# Altium schematic sheet 03-ORIN_HIGH_SPEED_SIGNAL_1.SchDoc: KARGOBOT-TBOX-V2.0
size 513 x 386 mm; Page Create Date: March  8, 1995; Page Number: 6; Page Size: C; Page Count: 81; RevCode: A; DsnPath: C:\Users\Administrator\Desktop\123\KARGOBOT-TCU-ORIN-V1.1.DSN; SchematicName: KARGOBT-TCU-ORIN-V1.1; PageName: 06-ORIN_HIGH_SPEED_SIGNAL_1; PageSize: C; TopSchematic: True
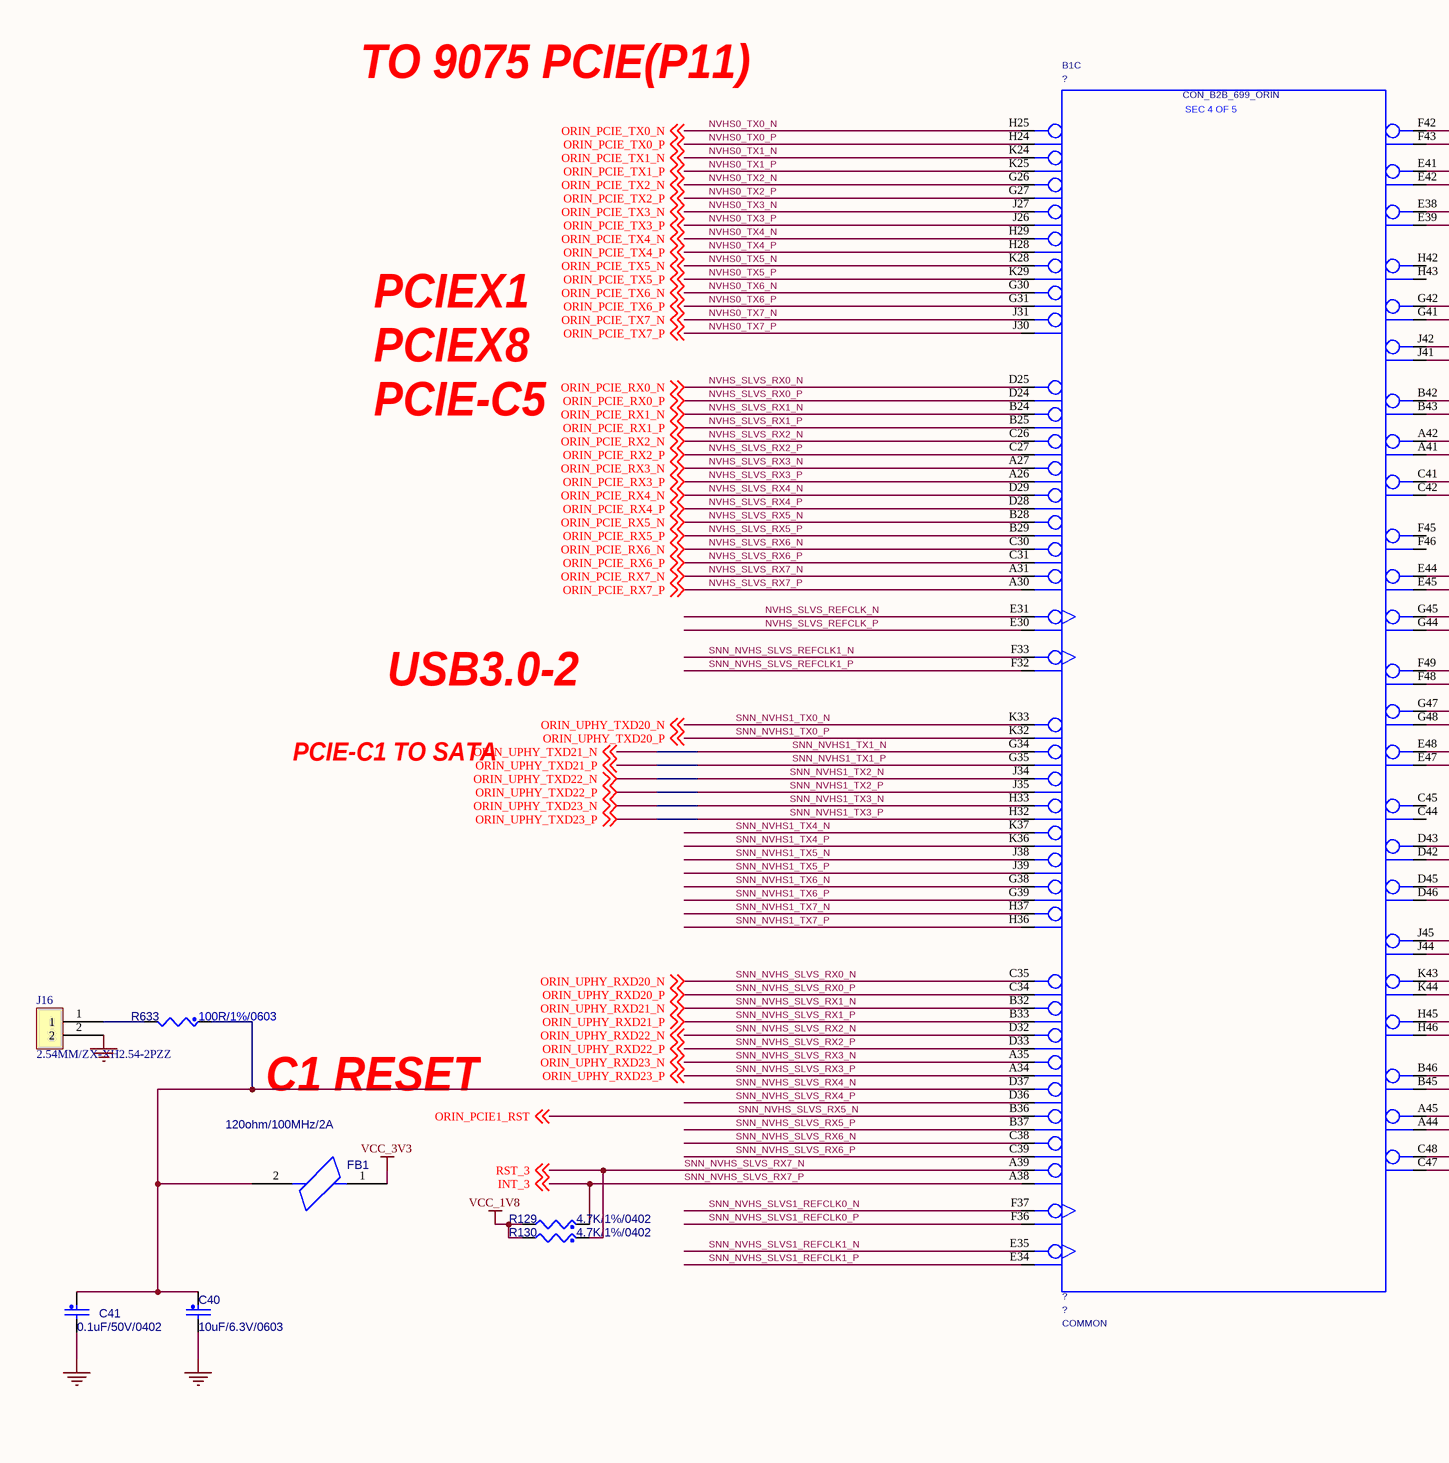
[diagram p0: 03-ORIN_HIGH_SPEED_SIGNAL_1.SchDoc, left]
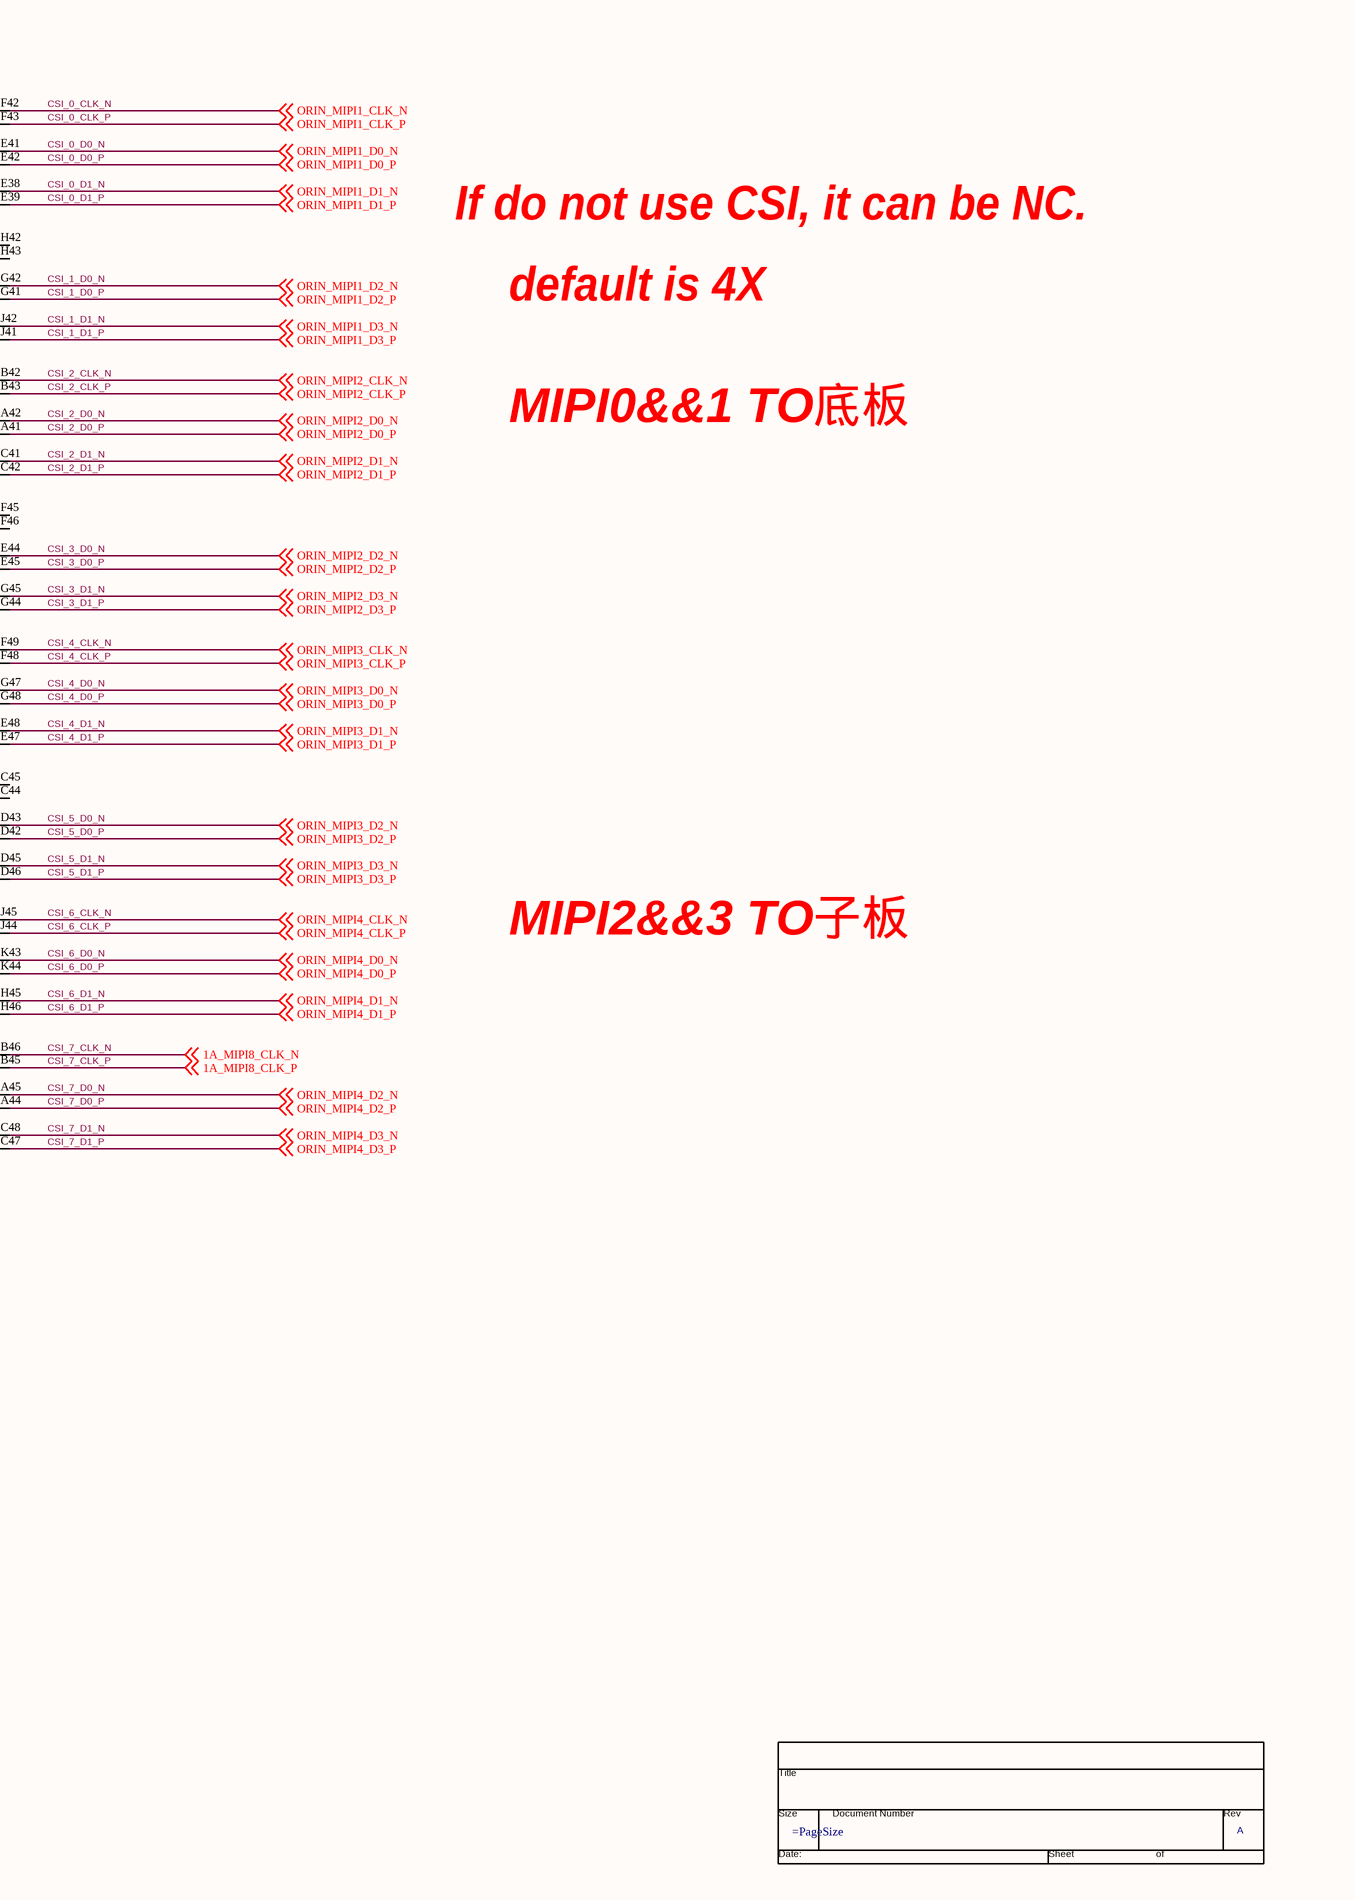
[diagram p1: 03-ORIN_HIGH_SPEED_SIGNAL_1.SchDoc, right]

## Parts
*  RevCode: A  (graphical)
B1  SKU: COMMON  [CON_MIRMEZ_699_BGA_ST_P009_P013_P015_REVERSE]  (hidden comment: CON_B2B_699_ORIN)  (part C of 5)
C40  value 10uF/6.3V/0603  [C0603]  (hidden comment: CAP_NP)
C41  value 0.1uF/50V/0402  [C0402]  (hidden comment: CAP_NP)
FB1  value 120ohm/100MHz/2A  [L0603]  (hidden comment: BEAD_FERRITE)
J16  2.54MM/ZX-XH2.54-2PZZ  [CONN-TH_2P-P2.50_HX25003-2A]
R129  value 4.7K/1%/0402  [R0402]  (hidden comment: RES_Dup2)
R130  value 4.7K/1%/0402  [R0402]  (hidden comment: RES_Dup2)
R633  value 100R/1%/0603  [R0603]  (hidden comment: RES_Dup2)

## Nets
GND: C40.2 C41.2 J16.2
VCC_1V8: R129.2 R130.2
VCC_3V3: FB1.1
CSI_0_CLK_N: B1.F42(CSI0_CLK_N) ; off-sheet ORIN_MIPI1_CLK_N  [also labelled ORIN_MIPI1_CLK_N]
CSI_0_CLK_P: B1.F43(CSI0_CLK_P) ; off-sheet ORIN_MIPI1_CLK_P  [also labelled ORIN_MIPI1_CLK_P]
CSI_0_D0_N: B1.E41(CSI0_D0_N) ; off-sheet ORIN_MIPI1_D0_N  [also labelled ORIN_MIPI1_D0_N]
CSI_0_D0_P: B1.E42(CSI0_D0_P) ; off-sheet ORIN_MIPI1_D0_P  [also labelled ORIN_MIPI1_D0_P]
CSI_0_D1_N: B1.E38(CSI0_D1_N) ; off-sheet ORIN_MIPI1_D1_N  [also labelled ORIN_MIPI1_D1_N]
CSI_0_D1_P: B1.E39(CSI0_D1_P) ; off-sheet ORIN_MIPI1_D1_P  [also labelled ORIN_MIPI1_D1_P]
CSI_1_D0_N: B1.G42(CSI1_D0_N) ; off-sheet ORIN_MIPI1_D2_N  [also labelled ORIN_MIPI1_D2_N]
CSI_1_D0_P: B1.G41(CSI1_D0_P) ; off-sheet ORIN_MIPI1_D2_P  [also labelled ORIN_MIPI1_D2_P]
CSI_1_D1_N: B1.J42(CSI1_D1_N) ; off-sheet ORIN_MIPI1_D3_N  [also labelled ORIN_MIPI1_D3_N]
CSI_1_D1_P: B1.J41(CSI1_D1_P) ; off-sheet ORIN_MIPI1_D3_P  [also labelled ORIN_MIPI1_D3_P]
CSI_2_CLK_N: B1.B42(CSI2_CLK_N) ; off-sheet ORIN_MIPI2_CLK_N  [also labelled ORIN_MIPI2_CLK_N]
CSI_2_CLK_P: B1.B43(CSI2_CLK_P) ; off-sheet ORIN_MIPI2_CLK_P  [also labelled ORIN_MIPI2_CLK_P]
CSI_2_D0_N: B1.A42(CSI2_D0_N) ; off-sheet ORIN_MIPI2_D0_N  [also labelled ORIN_MIPI2_D0_N]
CSI_2_D0_P: B1.A41(CSI2_D0_P) ; off-sheet ORIN_MIPI2_D0_P  [also labelled ORIN_MIPI2_D0_P]
CSI_2_D1_N: B1.C41(CSI2_D1_N) ; off-sheet ORIN_MIPI2_D1_N  [also labelled ORIN_MIPI2_D1_N]
CSI_2_D1_P: B1.C42(CSI2_D1_P) ; off-sheet ORIN_MIPI2_D1_P  [also labelled ORIN_MIPI2_D1_P]
CSI_3_D0_N: B1.E44(CSI3_D0_N) ; off-sheet ORIN_MIPI2_D2_N  [also labelled ORIN_MIPI2_D2_N]
CSI_3_D0_P: B1.E45(CSI3_D0_P) ; off-sheet ORIN_MIPI2_D2_P  [also labelled ORIN_MIPI2_D2_P]
CSI_3_D1_N: B1.G45(CSI3_D1_N) ; off-sheet ORIN_MIPI2_D3_N  [also labelled ORIN_MIPI2_D3_N]
CSI_3_D1_P: B1.G44(CSI3_D1_P) ; off-sheet ORIN_MIPI2_D3_P  [also labelled ORIN_MIPI2_D3_P]
CSI_4_CLK_N: B1.F49(CSI4_CLK_N) ; off-sheet ORIN_MIPI3_CLK_N  [also labelled ORIN_MIPI3_CLK_N]
CSI_4_CLK_P: B1.F48(CSI4_CLK_P) ; off-sheet ORIN_MIPI3_CLK_P  [also labelled ORIN_MIPI3_CLK_P]
CSI_4_D0_N: B1.G47(CSI4_D0_N) ; off-sheet ORIN_MIPI3_D0_N  [also labelled ORIN_MIPI3_D0_N]
CSI_4_D0_P: B1.G48(CSI4_D0_P) ; off-sheet ORIN_MIPI3_D0_P  [also labelled ORIN_MIPI3_D0_P]
CSI_4_D1_N: B1.E48(CSI4_D1_N) ; off-sheet ORIN_MIPI3_D1_N  [also labelled ORIN_MIPI3_D1_N]
CSI_4_D1_P: B1.E47(CSI4_D1_P) ; off-sheet ORIN_MIPI3_D1_P  [also labelled ORIN_MIPI3_D1_P]
CSI_5_D0_N: B1.D43(CSI5_D0_N) ; off-sheet ORIN_MIPI3_D2_N  [also labelled ORIN_MIPI3_D2_N]
CSI_5_D0_P: B1.D42(CSI5_D0_P) ; off-sheet ORIN_MIPI3_D2_P  [also labelled ORIN_MIPI3_D2_P]
CSI_5_D1_N: B1.D45(CSI5_D1_N) ; off-sheet ORIN_MIPI3_D3_N  [also labelled ORIN_MIPI3_D3_N]
CSI_5_D1_P: B1.D46(CSI5_D1_P) ; off-sheet ORIN_MIPI3_D3_P  [also labelled ORIN_MIPI3_D3_P]
CSI_6_CLK_N: B1.J45(CSI6_CLK_N) ; off-sheet ORIN_MIPI4_CLK_N  [also labelled ORIN_MIPI4_CLK_N]
CSI_6_CLK_P: B1.J44(CSI6_CLK_P) ; off-sheet ORIN_MIPI4_CLK_P  [also labelled ORIN_MIPI4_CLK_P]
CSI_6_D0_N: B1.K43(CSI6_D0_N) ; off-sheet ORIN_MIPI4_D0_N  [also labelled ORIN_MIPI4_D0_N]
CSI_6_D0_P: B1.K44(CSI6_D0_P) ; off-sheet ORIN_MIPI4_D0_P  [also labelled ORIN_MIPI4_D0_P]
CSI_6_D1_N: B1.H45(CSI6_D1_N) ; off-sheet ORIN_MIPI4_D1_N  [also labelled ORIN_MIPI4_D1_N]
CSI_6_D1_P: B1.H46(CSI6_D1_P) ; off-sheet ORIN_MIPI4_D1_P  [also labelled ORIN_MIPI4_D1_P]
CSI_7_CLK_N: B1.B46(CSI7_CLK_N) ; off-sheet 1A_MIPI8_CLK_N  [also labelled 1A_MIPI8_CLK_N]
CSI_7_CLK_P: B1.B45(CSI7_CLK_P) ; off-sheet 1A_MIPI8_CLK_P  [also labelled 1A_MIPI8_CLK_P]
CSI_7_D0_N: B1.A45(CSI7_D0_N) ; off-sheet ORIN_MIPI4_D2_N  [also labelled ORIN_MIPI4_D2_N]
CSI_7_D0_P: B1.A44(CSI7_D0_P) ; off-sheet ORIN_MIPI4_D2_P  [also labelled ORIN_MIPI4_D2_P]
CSI_7_D1_N: B1.C48(CSI7_D1_N) ; off-sheet ORIN_MIPI4_D3_N  [also labelled ORIN_MIPI4_D3_N]
CSI_7_D1_P: B1.C47(CSI7_D1_P) ; off-sheet ORIN_MIPI4_D3_P  [also labelled ORIN_MIPI4_D3_P]
NVHS0_TX0_N: B1.H25(NVHS0_TX0_N) ; off-sheet ORIN_PCIE_TX0_N  [also labelled ORIN_PCIE_TX0_N]
NVHS0_TX0_P: B1.H24(NVHS0_TX0_P) ; off-sheet ORIN_PCIE_TX0_P  [also labelled ORIN_PCIE_TX0_P]
NVHS0_TX1_N: B1.K24(NVHS0_TX1_N) ; off-sheet ORIN_PCIE_TX1_N  [also labelled ORIN_PCIE_TX1_N]
NVHS0_TX1_P: B1.K25(NVHS0_TX1_P) ; off-sheet ORIN_PCIE_TX1_P  [also labelled ORIN_PCIE_TX1_P]
NVHS0_TX2_N: B1.G26(NVHS0_TX2_N) ; off-sheet ORIN_PCIE_TX2_N  [also labelled ORIN_PCIE_TX2_N]
NVHS0_TX2_P: B1.G27(NVHS0_TX2_P) ; off-sheet ORIN_PCIE_TX2_P  [also labelled ORIN_PCIE_TX2_P]
NVHS0_TX3_N: B1.J27(NVHS0_TX3_N) ; off-sheet ORIN_PCIE_TX3_N  [also labelled ORIN_PCIE_TX3_N]
NVHS0_TX3_P: B1.J26(NVHS0_TX3_P) ; off-sheet ORIN_PCIE_TX3_P  [also labelled ORIN_PCIE_TX3_P]
NVHS0_TX4_N: B1.H29(NVHS0_TX4_N) ; off-sheet ORIN_PCIE_TX4_N  [also labelled ORIN_PCIE_TX4_N]
NVHS0_TX4_P: B1.H28(NVHS0_TX4_P) ; off-sheet ORIN_PCIE_TX4_P  [also labelled ORIN_PCIE_TX4_P]
NVHS0_TX5_N: B1.K28(NVHS0_TX5_N) ; off-sheet ORIN_PCIE_TX5_N  [also labelled ORIN_PCIE_TX5_N]
NVHS0_TX5_P: B1.K29(NVHS0_TX5_P) ; off-sheet ORIN_PCIE_TX5_P  [also labelled ORIN_PCIE_TX5_P]
NVHS0_TX6_N: B1.G30(NVHS0_TX6_N) ; off-sheet ORIN_PCIE_TX6_N  [also labelled ORIN_PCIE_TX6_N]
NVHS0_TX6_P: B1.G31(NVHS0_TX6_P) ; off-sheet ORIN_PCIE_TX6_P  [also labelled ORIN_PCIE_TX6_P]
NVHS0_TX7_N: B1.J31(NVHS0_TX7_N) ; off-sheet ORIN_PCIE_TX7_N  [also labelled ORIN_PCIE_TX7_N]
NVHS0_TX7_P: B1.J30(NVHS0_TX7_P) ; off-sheet ORIN_PCIE_TX7_P  [also labelled ORIN_PCIE_TX7_P]
NVHS_SLVS_REFCLK_N: B1.E31(NVHS0_SLVS_REFCLK0_N)
NVHS_SLVS_REFCLK_P: B1.E30(NVHS0_SLVS_REFCLK0_P)
NVHS_SLVS_RX0_N: B1.D25(NVHS0_SLVS_RX0_N) ; off-sheet ORIN_PCIE_RX0_N  [also labelled ORIN_PCIE_RX0_N]
NVHS_SLVS_RX0_P: B1.D24(NVHS0_SLVS_RX0_P) ; off-sheet ORIN_PCIE_RX0_P  [also labelled ORIN_PCIE_RX0_P]
NVHS_SLVS_RX1_N: B1.B24(NVHS0_SLVS_RX1_N) ; off-sheet ORIN_PCIE_RX1_N  [also labelled ORIN_PCIE_RX1_N]
NVHS_SLVS_RX1_P: B1.B25(NVHS0_SLVS_RX1_P) ; off-sheet ORIN_PCIE_RX1_P  [also labelled ORIN_PCIE_RX1_P]
NVHS_SLVS_RX2_N: B1.C26(NVHS0_SLVS_RX2_N) ; off-sheet ORIN_PCIE_RX2_N  [also labelled ORIN_PCIE_RX2_N]
NVHS_SLVS_RX2_P: B1.C27(NVHS0_SLVS_RX2_P) ; off-sheet ORIN_PCIE_RX2_P  [also labelled ORIN_PCIE_RX2_P]
NVHS_SLVS_RX3_N: B1.A27(NVHS0_SLVS_RX3_N) ; off-sheet ORIN_PCIE_RX3_N  [also labelled ORIN_PCIE_RX3_N]
NVHS_SLVS_RX3_P: B1.A26(NVHS0_SLVS_RX3_P) ; off-sheet ORIN_PCIE_RX3_P  [also labelled ORIN_PCIE_RX3_P]
NVHS_SLVS_RX4_N: B1.D29(NVHS0_SLVS_RX4_N) ; off-sheet ORIN_PCIE_RX4_N  [also labelled ORIN_PCIE_RX4_N]
NVHS_SLVS_RX4_P: B1.D28(NVHS0_SLVS_RX4_P) ; off-sheet ORIN_PCIE_RX4_P  [also labelled ORIN_PCIE_RX4_P]
NVHS_SLVS_RX5_N: B1.B28(NVHS0_SLVS_RX5_N) ; off-sheet ORIN_PCIE_RX5_N  [also labelled ORIN_PCIE_RX5_N]
NVHS_SLVS_RX5_P: B1.B29(NVHS0_SLVS_RX5_P) ; off-sheet ORIN_PCIE_RX5_P  [also labelled ORIN_PCIE_RX5_P]
NVHS_SLVS_RX6_N: B1.C30(NVHS0_SLVS_RX6_N) ; off-sheet ORIN_PCIE_RX6_N  [also labelled ORIN_PCIE_RX6_N]
NVHS_SLVS_RX6_P: B1.C31(NVHS0_SLVS_RX6_P) ; off-sheet ORIN_PCIE_RX6_P  [also labelled ORIN_PCIE_RX6_P]
NVHS_SLVS_RX7_N: B1.A31(NVHS0_SLVS_RX7_N) ; off-sheet ORIN_PCIE_RX7_N  [also labelled ORIN_PCIE_RX7_N]
NVHS_SLVS_RX7_P: B1.A30(NVHS0_SLVS_RX7_P) ; off-sheet ORIN_PCIE_RX7_P  [also labelled ORIN_PCIE_RX7_P]
SNN_NVHS1_TX0_N: B1.K33(NVHS1_TX0_N) ; off-sheet ORIN_UPHY_TXD20_N  [also labelled ORIN_UPHY_TXD20_N]
SNN_NVHS1_TX0_P: B1.K32(NVHS1_TX0_P) ; off-sheet ORIN_UPHY_TXD20_P  [also labelled ORIN_UPHY_TXD20_P]
SNN_NVHS1_TX1_N: B1.G34(NVHS1_TX1_N) ; off-sheet ORIN_UPHY_TXD21_N  [also labelled ORIN_UPHY_TXD21_N]
SNN_NVHS1_TX1_P: B1.G35(NVHS1_TX1_P) ; off-sheet ORIN_UPHY_TXD21_P  [also labelled ORIN_UPHY_TXD21_P]
SNN_NVHS1_TX2_N: B1.J34(NVHS1_TX2_N) ; off-sheet ORIN_UPHY_TXD22_N  [also labelled ORIN_UPHY_TXD22_N]
SNN_NVHS1_TX2_P: B1.J35(NVHS1_TX2_P) ; off-sheet ORIN_UPHY_TXD22_P  [also labelled ORIN_UPHY_TXD22_P]
SNN_NVHS1_TX3_N: B1.H33(NVHS1_TX3_N) ; off-sheet ORIN_UPHY_TXD23_N  [also labelled ORIN_UPHY_TXD23_N]
SNN_NVHS1_TX3_P: B1.H32(NVHS1_TX3_P) ; off-sheet ORIN_UPHY_TXD23_P  [also labelled ORIN_UPHY_TXD23_P]
SNN_NVHS1_TX4_N: B1.K37(NVHS1_TX4_N)
SNN_NVHS1_TX4_P: B1.K36(NVHS1_TX4_P)
SNN_NVHS1_TX5_N: B1.J38(NVHS1_TX5_N)
SNN_NVHS1_TX5_P: B1.J39(NVHS1_TX5_P)
SNN_NVHS1_TX6_N: B1.G38(NVHS1_TX6_N)
SNN_NVHS1_TX6_P: B1.G39(NVHS1_TX6_P)
SNN_NVHS1_TX7_N: B1.H37(NVHS1_TX7_N)
SNN_NVHS1_TX7_P: B1.H36(NVHS1_TX7_P)
SNN_NVHS_SLVS1_REFCLK0_N: B1.F37(NVHS1_SLVS_REFCLK0_N)
SNN_NVHS_SLVS1_REFCLK0_P: B1.F36(NVHS1_SLVS_REFCLK0_P)
SNN_NVHS_SLVS1_REFCLK1_N: B1.E35(NVHS1_SLVS_REFCLK1_N)
SNN_NVHS_SLVS1_REFCLK1_P: B1.E34(NVHS1_SLVS_REFCLK1_P)
SNN_NVHS_SLVS_REFCLK1_N: B1.F33(NVHS0_SLVS_REFCLK1_N)
SNN_NVHS_SLVS_REFCLK1_P: B1.F32(NVHS0_SLVS_REFCLK1_P)
SNN_NVHS_SLVS_RX0_N: B1.C35(NVHS1_SLVS_RX0_N) ; off-sheet ORIN_UPHY_RXD20_N  [also labelled ORIN_UPHY_RXD20_N]
SNN_NVHS_SLVS_RX0_P: B1.C34(NVHS1_SLVS_RX0_P) ; off-sheet ORIN_UPHY_RXD20_P  [also labelled ORIN_UPHY_RXD20_P]
SNN_NVHS_SLVS_RX1_N: B1.B32(NVHS1_SLVS_RX1_N) ; off-sheet ORIN_UPHY_RXD21_N  [also labelled ORIN_UPHY_RXD21_N]
SNN_NVHS_SLVS_RX1_P: B1.B33(NVHS1_SLVS_RX1_P) ; off-sheet ORIN_UPHY_RXD21_P  [also labelled ORIN_UPHY_RXD21_P]
SNN_NVHS_SLVS_RX2_N: B1.D32(NVHS1_SLVS_RX2_N) ; off-sheet ORIN_UPHY_RXD22_N  [also labelled ORIN_UPHY_RXD22_N]
SNN_NVHS_SLVS_RX2_P: B1.D33(NVHS1_SLVS_RX2_P) ; off-sheet ORIN_UPHY_RXD22_P  [also labelled ORIN_UPHY_RXD22_P]
SNN_NVHS_SLVS_RX3_N: B1.A35(NVHS1_SLVS_RX3_N) ; off-sheet ORIN_UPHY_RXD23_N  [also labelled ORIN_UPHY_RXD23_N]
SNN_NVHS_SLVS_RX3_P: B1.A34(NVHS1_SLVS_RX3_P) ; off-sheet ORIN_UPHY_RXD23_P  [also labelled ORIN_UPHY_RXD23_P]
SNN_NVHS_SLVS_RX4_N: B1.D37(NVHS1_SLVS_RX4_N) C40.1 C41.1 FB1.2 R633.1
SNN_NVHS_SLVS_RX4_P: B1.D36(NVHS1_SLVS_RX4_P)
SNN_NVHS_SLVS_RX5_N: B1.B36(NVHS1_SLVS_RX5_N) ; off-sheet ORIN_PCIE1_RST  [also labelled ORIN_PCIE1_RST]
SNN_NVHS_SLVS_RX5_P: B1.B37(NVHS1_SLVS_RX5_P)
SNN_NVHS_SLVS_RX6_N: B1.C38(NVHS1_SLVS_RX6_N)
SNN_NVHS_SLVS_RX6_P: B1.C39(NVHS1_SLVS_RX6_P)
SNN_NVHS_SLVS_RX7_N: B1.A39(NVHS1_SLVS_RX7_N) R130.1 ; off-sheet RST_3  [also labelled RST_3]
SNN_NVHS_SLVS_RX7_P: B1.A38(NVHS1_SLVS_RX7_P) R129.1 ; off-sheet INT_3  [also labelled INT_3]
NetJ16_1: J16.1 R633.2

Not connected (* = marked no-connect by the designer): B1 C44(CSI5_CLK_P) C45(CSI5_CLK_N) F45(CSI3_CLK_N) F46(CSI3_CLK_P) H42(CSI1_CLK_N) H43(CSI1_CLK_P)

## Notes on the sheet
- TO 9075 PCIE(P11)
- If do not use CSI, it can be NC.
- PCIEX8
- PCIEX1
- default is 4X
- PCIE-C5
- MIPI0&&1 TO底板
- USB3.0-2
- PCIE-C1 TO SATA
- MIPI2&&3 TO子板
- C1 RESET
- (in symbol CON_B2B_699, part C) SEC 4 OF 5
- (in symbol TitleBlock0) Title; Size; Document Number; Rev; Date:; Sheet; of

## Library data of the parts
* = TitleBlock0: Title: KARGOBOT-TBOX-V2.0; Page Number: 6; Page Count: 81; Page Create Date: March  8, 1995; Page Size: =PageSize; Page Modify Date: =ModifiedDate
B1 = CON_B2B_699: 2034560003/MOLEX; Part Reference: B1; OriginalSymbolOrigin: (-500,1750); ASSEMBLY: ?; DEVICE: CON_B2B_699_ORIN; NV_PN: ?; PACK_TYPE: ?; PATH: ?; PLACEMENT_NOTE: ?; Value: CON_B2B_699_ORIN; PCB Footprint: CON_MIRMEZ_699_BGA_ST_P009_P013_P015_REVERSE
C40 = CAP_NP: GCM188D70J106ME36/MURATA; Part Reference: C5851; CLASS: DISCRETE; VOLTAGE: 10v; CAD_APPROVED: Yes; MFG_PN01: C1608X5R1A106K; MFG_NAME01: TDK; TOL: 10%; AGILE_PN: 150-78675; FPLIST: CC0603_OV,CC0603,0603_CC; PCB Footprint: C0603; HEIGHT: 1.016MM; ROHS: Yes; Tolerance: 10%
C41 = CAP_NP: GCM155R71H104KE02/MURATA; Part Reference: C5850; CLASS: DISCRETE; FPLIST: CC0402_25,CC0402_HD,CC0402_CC; CAD_APPROVED: Yes; MFG_PN01: 0402YC104KAT2A; MFG_NAME01: AVX; Tolerance: 10%; AGILE_PN: 150-75182; VOLTAGE: 16V; PCB Footprint: C0402; HEIGHT: 0.635MM; ROHS: Yes; TOL: 10%
FB1 = BEAD_FERRITE: BLM18EG121SH1D/MURATA; Part Reference: FB182; PART_TYPE: FERRITE\BEAD; CLASS: DISCRETE; FPLIST: IND_0603A,0603_CC; CAD_APPROVED: Yes; MFG_PN01: BLM18KG121TN1; MFG_NAME01: MURATA; AGILE_PN: 180-78025; PCB Footprint: L0603; HEIGHT: 0.75MM; ROHS: Yes
J16 = header2
R129 = RES_Dup2: AC0402FR-074K7L/YAGEO; Part Reference: R140; CLASS: DISCRETE; FPLIST: RC0402_25,RC0402_HD,RC0402_CC; CAD_APPROVED: Yes; MFG_PN01: RK73B1ETTP472J; MFG_NAME01: KOA SPEER; Tolerance: 5%; AGILE_PN: 470-75626; ROHS: Yes; TOL: 5%; HEIGHT: 0.41mm; PCB Footprint: R0402
R130 = RES_Dup2: AC0402FR-074K7L/YAGEO; Part Reference: R141; CLASS: DISCRETE; FPLIST: RC0402_25,RC0402_HD,RC0402_CC; CAD_APPROVED: Yes; MFG_PN01: RK73B1ETTP472J; MFG_NAME01: KOA SPEER; Tolerance: 5%; AGILE_PN: 470-75626; ROHS: Yes; TOL: 5%; HEIGHT: 0.41mm; PCB Footprint: R0402
R633 = RES_Dup2: AC0402FR-070RL/YAGEO; Part Reference: R97; CLASS: DISCRETE; SIGNAL_MODEL: DEFAULT_RESISTOR_33.000000OHM_2_1; FPLIST: RC0603_OV; CAD_APPROVED: Yes; MFG_PN01: CR-02FL6---33R; MFG_NAME01: YAGEO; Tolerance: 1%; AGILE_PN: 470-75790; TOL: 5%; PCB Footprint: R0402; ROHS: Yes; HEIGHT: 0.4MM